# EAGLE schematic sound_gps (EAGLE 7.7.0)
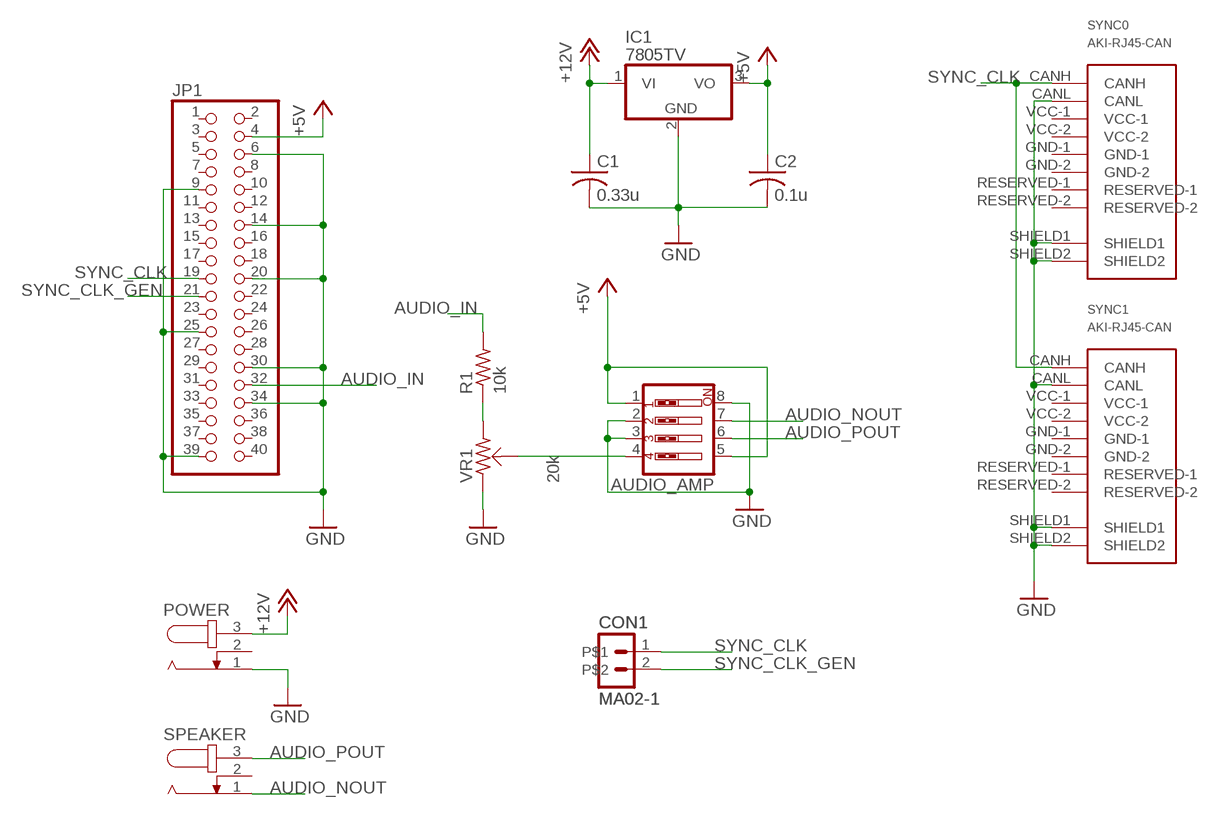
[diagram p0: schematic, sheet 1]

## Parts
AUDIO_AMP  SW_DIP-4  [EDG-04]
C1  0.33u  C-2012  [2012-C]
C2  0.1u  C-2012  [2012-C]
CON1  MA02-1  [MA02-1]
IC1  7805TV  [TO220V]
JP1  PINHD-2X20  [2X20]
POWER  JACK-PLUG0  [SPC4077]
R1  10k  R-1608  [1608]
SPEAKER  JACK-PLUG0  [SPC4077]
SYNC0  AKI-RJ45-CAN  [AKI-RJ45-CAN]
SYNC1  AKI-RJ45-CAN  [AKI-RJ45-CAN]
VR1  20k  VR  [VR-637A]

## Nets
+5V: AUDIO_AMP.1 AUDIO_AMP.5 C2.1 IC1.3(VO) JP1.4
+12V: C1.1 IC1.1(VI) POWER.3
AUDIO_IN: JP1.32 R1.2
AUDIO_NOUT: AUDIO_AMP.7 SPEAKER.1
AUDIO_POUT: AUDIO_AMP.6 SPEAKER.3
GND: AUDIO_AMP.2 AUDIO_AMP.3 AUDIO_AMP.8 C1.2 C2.2 IC1.2(GND) JP1.6 JP1.9 JP1.14 JP1.20 JP1.25 JP1.30 JP1.34 JP1.39 POWER.1 SYNC0.CANL SYNC0.SHIELD1 SYNC0.SHIELD2 SYNC1.CANL SYNC1.SHIELD1 SYNC1.SHIELD2 VR1.1
N$1: AUDIO_AMP.4 VR1.BR
N$2: R1.1 VR1.2
SYNC_CLK: CON1.1 JP1.19 SYNC0.CANH SYNC1.CANH
SYNC_CLK_GEN: CON1.2 JP1.21
Unconnected: JP1.1 JP1.2 JP1.3 JP1.5 JP1.7 JP1.8 JP1.10 JP1.11 JP1.12 JP1.13 JP1.15 JP1.16 JP1.17 JP1.18 JP1.22 JP1.23 JP1.24 JP1.26 JP1.27 JP1.28 JP1.29 JP1.31 JP1.33 JP1.35 JP1.36 JP1.37 JP1.38 JP1.40 POWER.2 SPEAKER.2 SYNC0.RESERVED-1 SYNC0.RESERVED-2 SYNC1.RESERVED-1 SYNC1.RESERVED-2

## Power pins joined to a net without a drawn wire
GND-1: SYNC0.GND-1 SYNC1.GND-1
GND-2: SYNC0.GND-2 SYNC1.GND-2
VCC-1: SYNC0.VCC-1 SYNC1.VCC-1
VCC-2: SYNC0.VCC-2 SYNC1.VCC-2

## Library data of the parts
AUDIO_AMP = special:SW_DIP-4: DIP SWITCH
C1 C2 = Passive_Robotech:C
CON1 = Connector_Robotech:MA02-1: Jumper Pin Header
IC1 = linear:78*: Positive VOLTAGE REGULATOR Source: http://cache.national.com/ds/LM/LM78L05.pdf http://www.fairchildsemi.com/ds/LM/LM7805.pdf
JP1 = pinhead:PINHD-2X20: PIN HEADER
POWER SPEAKER = con-jack:JACK-PLUG: DC POWER JACK Power Jack, DC, Right Angle, Through Hole, Rated 5A at 16VDC, PC Terminals Distributor: Farnell (www.Farnell.de) Drawing: 84N1161.pdf / 84N1162.pdf Manufacturer: SPC Technology (www.spctechnology.com) Type: SPC4077 / SPC 4078; OC_FARNELL: unknown; OC_NEWARK: unknown
R1 = Passive_Robotech:R
SYNC0 SYNC1 = Connector_Robotech:AKI-RJ45-CAN: Akizuki RJ-45 connector for CAN
VR1 = Passive_Robotech:VR